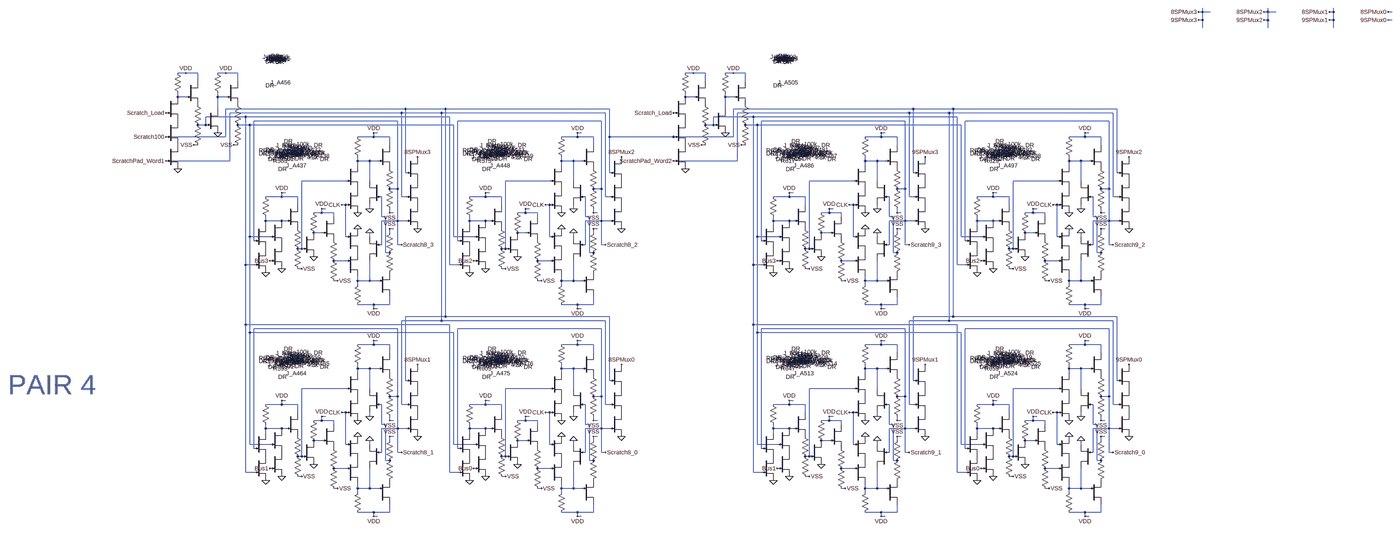
[diagram p0: schematic Pair 5.asc, whole sheet]
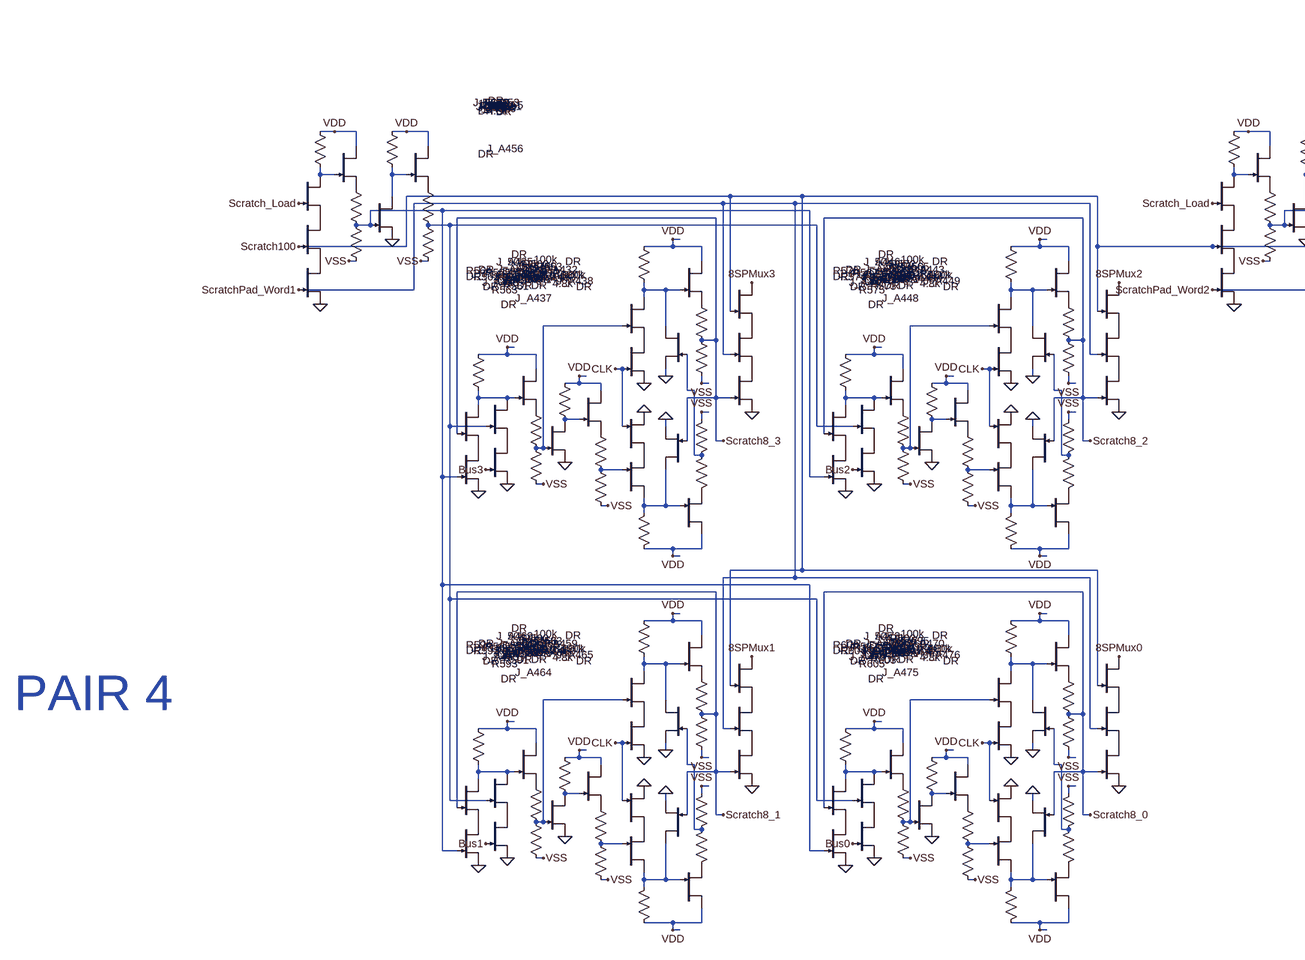
[diagram p1: schematic Pair 5.asc, part, row 1 of 1, column 1 of 2]
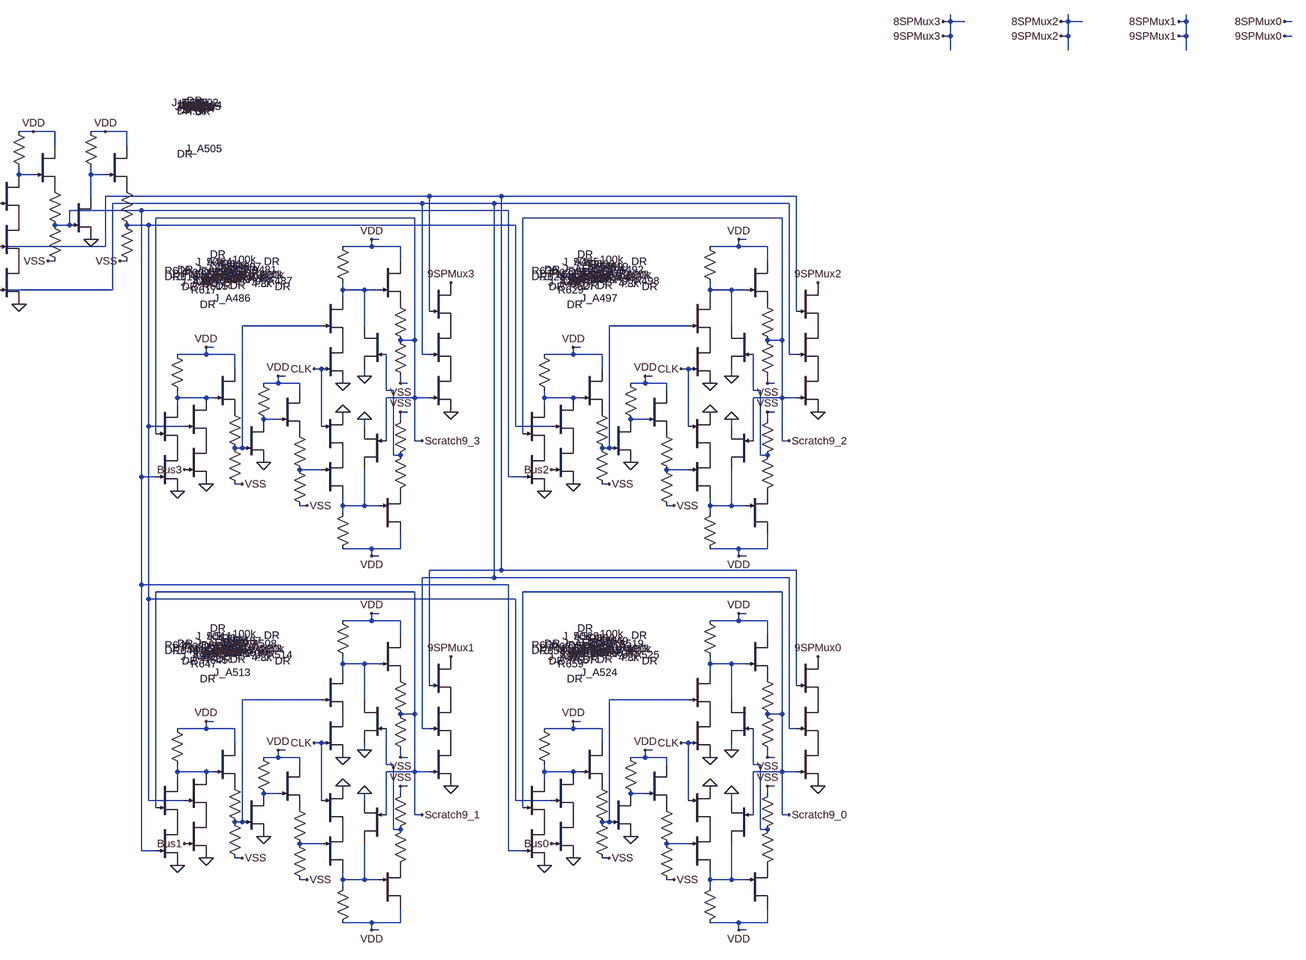
[diagram p2: schematic Pair 5.asc, part, row 1 of 1, column 2 of 2]
* Pair 5.asc
J_A430 N009 N013 P001 DR
R553 VDD N009 100k
J_F146 VDD N009 P002 DR
R554 P002 Scratch8_3 1k
R555 Scratch8_3 VSS 4.8k
J_B145 N009 N017 0 DR
J_A431 N033 N029 P003 DR
R556 VDD N033 100k
J_F147 VDD N033 P004 DR
R557 P004 N017 1k
R558 N017 VSS 4.8k
J_B146 N033 Scratch8_3 0 DR
J_A432 P001 CLK 0 DR
J_A433 P003 CLK 0 DR
J_A434 N021 Scratch8_3 P005 DR
R559 VDD N021 100k
J_F148 VDD N021 P006 DR
R560 P006 N013 1k
R561 N013 VSS 4.8k
J_B147 N021 N007 P007 DR
J_A435 N025 N013 0 DR
R562 VDD N025 50k
J_A436 VDD N025 P008 DR
R563 P008 N029 1k
R564 N029 VSS 4.5k
J_A437 P005 N005 0 DR
J_B148 P007 Bus3 0 DR
J_A438 P009 Scratch8_3 0 DR
J_A439 P010 ScratchPad_Word1 P009 DR
J_A440 9SPMux3 Scratch100 P010 DR
J_A441 N010 N014 P011 DR
R565 VDD N010 100k
J_F149 VDD N010 P012 DR
R566 P012 Scratch8_2 1k
R567 Scratch8_2 VSS 4.8k
J_B149 N010 N018 0 DR
J_A442 N034 N030 P013 DR
R568 VDD N034 100k
J_F150 VDD N034 P014 DR
R569 P014 N018 1k
R570 N018 VSS 4.8k
J_B150 N034 Scratch8_2 0 DR
J_A443 P011 CLK 0 DR
J_A444 P013 CLK 0 DR
J_A445 N022 Scratch8_2 P015 DR
R571 VDD N022 100k
J_F151 VDD N022 P016 DR
R572 P016 N014 1k
R573 N014 VSS 4.8k
J_B151 N022 N007 P017 DR
J_A446 N026 N014 0 DR
R574 VDD N026 50k
J_A447 VDD N026 P018 DR
R575 P018 N030 1k
R576 N030 VSS 4.5k
J_A448 P015 N005 0 DR
J_B152 P017 Bus2 0 DR
J_A449 P019 Scratch8_2 0 DR
J_A450 P020 ScratchPad_Word1 P019 DR
J_A451 9SPMux2 Scratch100 P020 DR
R577 VDD N001 100k
J_F152 VDD N001 P021 DR
R578 P021 N005 1k
R579 N005 VSS 4.8k
J_A452 N002 N005 0 DR
R580 VDD N002 50k
J_A453 VDD N002 P022 DR
R581 P022 N007 1k
R582 VSS N007 4.5k
J_A454 N001 Scratch_Load P023 DR
J_A455 P023 Scratch100 P024 DR
J_A456 P024 ScratchPad_Word1 0 DR
J_A457 N037 N041 P025 DR
R583 VDD N037 100k
J_F153 VDD N037 P026 DR
R584 P026 Scratch8_1 1k
R585 Scratch8_1 VSS 4.8k
J_B153 N037 N045 0 DR
J_A458 N061 N057 P027 DR
R586 VDD N061 100k
J_F154 VDD N061 P028 DR
R587 P028 N045 1k
R588 N045 VSS 4.8k
J_B154 N061 Scratch8_1 0 DR
J_A459 P025 CLK 0 DR
J_A460 P027 CLK 0 DR
J_A461 N049 Scratch8_1 P029 DR
R589 VDD N049 100k
J_F155 VDD N049 P030 DR
R590 P030 N041 1k
R591 N041 VSS 4.8k
J_B155 N049 N007 P031 DR
J_A462 N053 N041 0 DR
R592 VDD N053 50k
J_A463 VDD N053 P032 DR
R593 P032 N057 1k
R594 N057 VSS 4.5k
J_A464 P029 N005 0 DR
J_B156 P031 Bus1 0 DR
J_A465 P033 Scratch8_1 0 DR
J_A466 P034 ScratchPad_Word1 P033 DR
J_A467 9SPMux1 Scratch100 P034 DR
J_A468 N038 N042 P035 DR
R595 VDD N038 100k
J_F156 VDD N038 P036 DR
R596 P036 Scratch8_0 1k
R597 Scratch8_0 VSS 4.8k
J_B157 N038 N046 0 DR
J_A469 N062 N058 P037 DR
R598 VDD N062 100k
J_F157 VDD N062 P038 DR
R599 P038 N046 1k
R600 N046 VSS 4.8k
J_B158 N062 Scratch8_0 0 DR
J_A470 P035 CLK 0 DR
J_A471 P037 CLK 0 DR
J_A472 N050 Scratch8_0 P039 DR
R601 VDD N050 100k
J_F158 VDD N050 P040 DR
R602 P040 N042 1k
R603 N042 VSS 4.8k
J_B159 N050 N007 P041 DR
J_A473 N054 N042 0 DR
R604 VDD N054 50k
J_A474 VDD N054 P042 DR
R605 P042 N058 1k
R606 N058 VSS 4.5k
J_A475 P039 N005 0 DR
J_B160 P041 Bus0 0 DR
J_A476 P043 Scratch8_0 0 DR
J_A477 P044 ScratchPad_Word1 P043 DR
J_A478 8SPMux0 Scratch100 P044 DR
J_A479 N011 N015 P045 DR
R607 VDD N011 100k
J_F159 VDD N011 P046 DR
R608 P046 Scratch9_3 1k
R609 Scratch9_3 VSS 4.8k
J_B161 N011 N019 0 DR
J_A480 N035 N031 P047 DR
R610 VDD N035 100k
J_F160 VDD N035 P048 DR
R611 P048 N019 1k
R612 N019 VSS 4.8k
J_B162 N035 Scratch9_3 0 DR
J_A481 P045 CLK 0 DR
J_A482 P047 CLK 0 DR
J_A483 N023 Scratch9_3 P049 DR
R613 VDD N023 100k
J_F161 VDD N023 P050 DR
R614 P050 N015 1k
R615 N015 VSS 4.8k
J_B163 N023 N008 P051 DR
J_A484 N027 N015 0 DR
R616 VDD N027 50k
J_A485 VDD N027 P052 DR
R617 P052 N031 1k
R618 N031 VSS 4.5k
J_A486 P049 N006 0 DR
J_B164 P051 Bus3 0 DR
J_A487 P053 Scratch9_3 0 DR
J_A488 P054 ScratchPad_Word2 P053 DR
J_A489 9SPMux3 Scratch100 P054 DR
J_A490 N012 N016 P055 DR
R619 VDD N012 100k
J_F162 VDD N012 P056 DR
R620 P056 Scratch9_2 1k
R621 Scratch9_2 VSS 4.8k
J_B165 N012 N020 0 DR
J_A491 N036 N032 P057 DR
R622 VDD N036 100k
J_F163 VDD N036 P058 DR
R623 P058 N020 1k
R624 N020 VSS 4.8k
J_B166 N036 Scratch9_2 0 DR
J_A492 P055 CLK 0 DR
J_A493 P057 CLK 0 DR
J_A494 N024 Scratch9_2 P059 DR
R625 VDD N024 100k
J_F164 VDD N024 P060 DR
R626 P060 N016 1k
R627 N016 VSS 4.8k
J_B167 N024 N008 P061 DR
J_A495 N028 N016 0 DR
R628 VDD N028 50k
J_A496 VDD N028 P062 DR
R629 P062 N032 1k
R630 N032 VSS 4.5k
J_A497 P059 N006 0 DR
J_B168 P061 Bus2 0 DR
J_A498 P063 Scratch9_2 0 DR
J_A499 P064 ScratchPad_Word2 P063 DR
J_A500 9SPMux2 Scratch100 P064 DR
R631 VDD N003 100k
J_F165 VDD N003 P065 DR
R632 P065 N006 1k
R633 N006 VSS 4.8k
J_A501 N004 N006 0 DR
R634 VDD N004 50k
J_A502 VDD N004 P066 DR
R635 P066 N008 1k
R636 VSS N008 4.5k
J_A503 N003 Scratch_Load P067 DR
J_A504 P067 Scratch100 P068 DR
J_A505 P068 ScratchPad_Word2 0 DR
J_A506 N039 N043 P069 DR
R637 VDD N039 100k
J_F166 VDD N039 P070 DR
R638 P070 Scratch9_1 1k
R639 Scratch9_1 VSS 4.8k
J_B169 N039 N047 0 DR
J_A507 N063 N059 P071 DR
R640 VDD N063 100k
J_F167 VDD N063 P072 DR
R641 P072 N047 1k
R642 N047 VSS 4.8k
J_B170 N063 Scratch9_1 0 DR
J_A508 P069 CLK 0 DR
J_A509 P071 CLK 0 DR
J_A510 N051 Scratch9_1 P073 DR
R643 VDD N051 100k
J_F168 VDD N051 P074 DR
R644 P074 N043 1k
R645 N043 VSS 4.8k
J_B171 N051 N008 P075 DR
J_A511 N055 N043 0 DR
R646 VDD N055 50k
J_A512 VDD N055 P076 DR
R647 P076 N059 1k
R648 N059 VSS 4.5k
J_A513 P073 N006 0 DR
J_B172 P075 Bus1 0 DR
J_A514 P077 Scratch9_1 0 DR
J_A515 P078 ScratchPad_Word2 P077 DR
J_A516 9SPMux1 Scratch100 P078 DR
J_A517 N040 N044 P079 DR
R649 VDD N040 100k
J_F169 VDD N040 P080 DR
R650 P080 Scratch9_0 1k
R651 Scratch9_0 VSS 4.8k
J_B173 N040 N048 0 DR
J_A518 N064 N060 P081 DR
R652 VDD N064 100k
J_F170 VDD N064 P082 DR
R653 P082 N048 1k
R654 N048 VSS 4.8k
J_B174 N064 Scratch9_0 0 DR
J_A519 P079 CLK 0 DR
J_A520 P081 CLK 0 DR
J_A521 N052 Scratch9_0 P083 DR
R655 VDD N052 100k
J_F171 VDD N052 P084 DR
R656 P084 N044 1k
R657 N044 VSS 4.8k
J_B175 N052 N008 P085 DR
J_A522 N056 N044 0 DR
R658 VDD N056 50k
J_A523 VDD N056 P086 DR
R659 P086 N060 1k
R660 N060 VSS 4.5k
J_A524 P083 N006 0 DR
J_B176 P085 Bus0 0 DR
J_A525 P087 Scratch9_0 0 DR
J_A526 P088 ScratchPad_Word2 P087 DR
J_A527 9SPMux0 Scratch100 P088 DR
.model NJF NJF
.model PJF PJF
.lib standard.jft
* PAIR 4
.backanno
.end